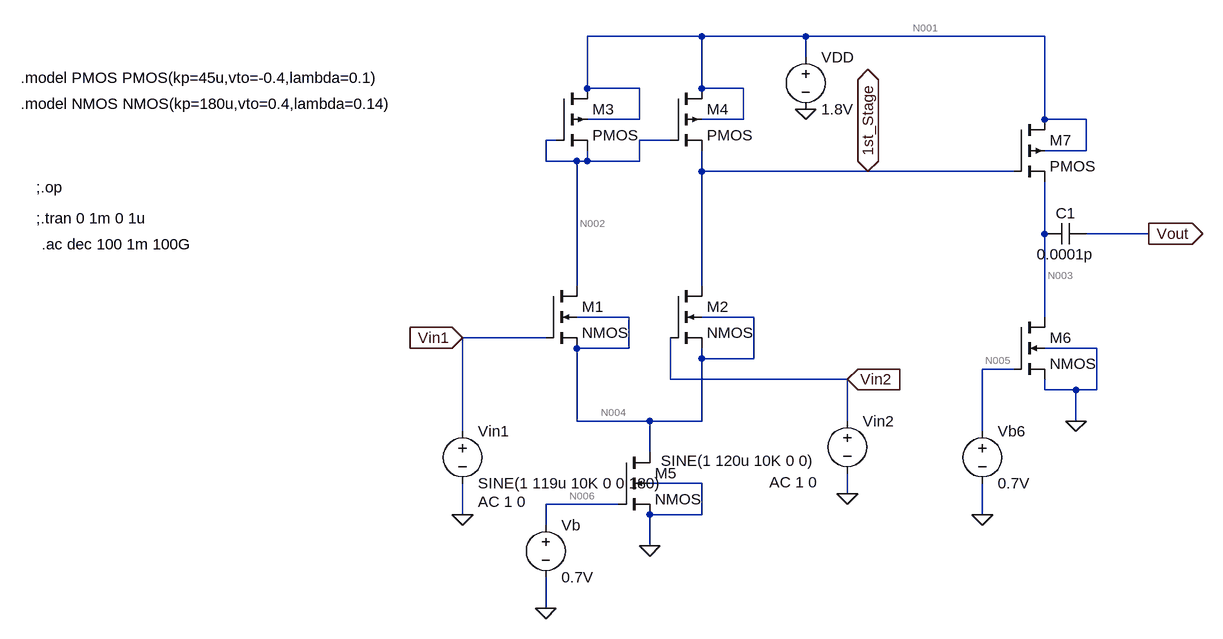
[diagram p0: schematic opamp.asc]
opamp.asc, the LTspice schematic file:
Version 4
SHEET 1 1836 1076
WIRE 224 176 48 176
WIRE 384 176 224 176
WIRE 752 176 384 176
WIRE 384 208 384 176
WIRE 48 256 48 176
WIRE 128 256 48 256
WIRE 224 256 224 176
WIRE 288 256 224 256
WIRE 128 304 128 256
WIRE 128 304 48 304
WIRE 288 304 288 256
WIRE 288 304 224 304
WIRE 752 304 752 176
WIRE 816 304 752 304
WIRE 0 336 -16 336
WIRE 176 336 128 336
WIRE 816 352 816 304
WIRE 816 352 752 352
WIRE -16 368 -16 336
WIRE 32 368 -16 368
WIRE 48 368 48 352
WIRE 48 368 32 368
WIRE 128 368 128 336
WIRE 128 368 48 368
WIRE 224 384 224 352
WIRE 480 384 224 384
WIRE 704 384 480 384
WIRE 752 480 752 400
WIRE 912 480 816 480
WIRE 32 560 32 368
WIRE 224 560 224 384
WIRE 112 608 32 608
WIRE 304 608 224 608
WIRE 752 608 752 480
WIRE -16 640 -144 640
WIRE 112 656 112 608
WIRE 112 656 32 656
WIRE 832 656 752 656
WIRE 224 672 224 656
WIRE 304 672 304 608
WIRE 304 672 224 672
WIRE 704 688 656 688
WIRE 176 704 176 640
WIRE 448 704 176 704
WIRE 752 720 752 704
WIRE 800 720 752 720
WIRE 832 720 832 656
WIRE 832 720 800 720
WIRE 32 768 32 656
WIRE 144 768 32 768
WIRE 224 768 224 672
WIRE 224 768 144 768
WIRE 448 768 448 704
WIRE 800 768 800 720
WIRE -144 784 -144 640
WIRE 656 784 656 688
WIRE 144 816 144 768
WIRE 224 864 144 864
WIRE 448 880 448 848
WIRE 96 896 -16 896
WIRE -144 912 -144 864
WIRE 224 912 224 864
WIRE 224 912 144 912
WIRE 656 912 656 864
WIRE -16 928 -16 896
WIRE 144 960 144 912
WIRE -16 1056 -16 1008
FLAG 384 288 0
FLAG -144 912 0
FLAG 448 880 0
FLAG -144 640 Vin1
IOPIN -144 640 In
FLAG 448 704 Vin2
IOPIN 448 704 In
FLAG 144 960 0
FLAG -16 1056 0
FLAG 656 912 0
FLAG 912 480 Vout
IOPIN 912 480 Out
FLAG 480 384 1st_Stage
IOPIN 480 384 BiDir
FLAG 800 768 0
SYMBOL pmos4 176 256 R0
SYMATTR InstName M4
SYMATTR Value2 l=0.8u w=10.25u
SYMBOL voltage 384 192 R0
WINDOW 123 0 0 Left 0
WINDOW 39 0 0 Left 0
SYMATTR InstName VDD
SYMATTR Value 1.8V
SYMBOL nmos4 176 560 R0
SYMATTR InstName M2
SYMATTR Value2 l=0.8u w=5.8u
SYMBOL pmos4 0 256 R0
SYMATTR InstName M3
SYMATTR Value2 l=0.8u w=10.25u
SYMBOL voltage -144 768 R0
WINDOW 123 24 124 Left 2
WINDOW 39 0 0 Left 0
SYMATTR Value2 AC 1 0
SYMATTR InstName Vin1
SYMATTR Value SINE(1 119u 10K 0 0 180)
SYMBOL nmos4 -16 560 R0
SYMATTR InstName M1
SYMATTR Value2 l=0.8u w=5.8u
SYMBOL voltage 448 752 R0
WINDOW 123 -120 110 Left 2
WINDOW 39 0 0 Left 0
WINDOW 3 -287 77 Left 2
SYMATTR Value2 AC 1 0
SYMATTR InstName Vin2
SYMATTR Value SINE(1 120u 10K 0 0)
SYMBOL nmos4 96 816 R0
SYMATTR InstName M5
SYMATTR Value2 l=0.8u w=9.87u
SYMBOL voltage -16 912 R0
WINDOW 123 24 124 Left 2
WINDOW 39 0 0 Left 0
SYMATTR InstName Vb
SYMATTR Value 0.7V
SYMBOL pmos4 704 304 R0
SYMATTR InstName M7
SYMATTR Value2 l=0.8u w=20.5u
SYMBOL cap 816 464 R90
WINDOW 0 0 32 VBottom 2
WINDOW 3 32 32 VTop 2
SYMATTR InstName C1
SYMATTR Value 0.0001p
SYMBOL nmos4 704 608 R0
SYMATTR InstName M6
SYMATTR Value2 l=0.8u w=9.87u
SYMBOL voltage 656 768 R0
WINDOW 123 24 124 Left 2
WINDOW 39 0 0 Left 0
SYMATTR InstName Vb6
SYMATTR Value 0.7V
TEXT -800 456 Left 2 !;.tran 0 1m 0 1u
TEXT -800 408 Left 2 !;.op
TEXT -792 496 Left 2 !.ac dec 100 1m 100G
TEXT -824 280 Left 2 !.model NMOS NMOS(kp=180u,vto=0.4,lambda=0.14)
TEXT -824 240 Left 2 !.model PMOS PMOS(kp=45u,vto=-0.4,lambda=0.1)

The netlist it stands for:
* opamp.asc
M4 N001 N002 1st_Stage N001 PMOS l=0.8u w=10.25u
VDD N001 0 1.8V
M2 1st_Stage Vin2 N004 N004 NMOS l=0.8u w=5.8u
M3 N001 N002 N002 N001 PMOS l=0.8u w=10.25u
Vin1 Vin1 0 SINE(1 119u 10K 0 0 180) AC 1 0
M1 N002 Vin1 N004 N004 NMOS l=0.8u w=5.8u
Vin2 Vin2 0 SINE(1 120u 10K 0 0) AC 1 0
M5 N004 N006 0 0 NMOS l=0.8u w=9.87u
Vb N006 0 0.7V
M7 N001 1st_Stage N003 N001 PMOS l=0.8u w=20.5u
C1 Vout N003 0.0001p
M6 N003 N005 0 0 NMOS l=0.8u w=9.87u
Vb6 N005 0 0.7V
.model NMOS NMOS
.model PMOS PMOS
.lib standard.mos
;.tran 0 1m 0 1u
;.op
.ac dec 100 1m 100G
.model NMOS NMOS(kp=180u,vto=0.4,lambda=0.14)
.model PMOS PMOS(kp=45u,vto=-0.4,lambda=0.1)
.backanno
.end

* Results of the author's LTspice run, read from the files saved beside the schematic
* Operating Point, zero values left out:
*   V(n001) = 1.8 V
*   V(n002) = 990.4 mV
*   V(1st_stage) = 990.4 mV
*   V(vin2) = 1 V
*   V(n004) = 329.2 mV
*   V(vin1) = 1 V
*   V(n006) = 700 mV
*   V(n003) = 599.5 mV
*   V(n005) = 700 mV
*   Id(M6) = 108.3 µA
*   Is(M6) = -108.3 µA
*   Id(M5) = 104.5 µA
*   Is(M5) = -104.5 µA
*   Id(M1) = 52.27 µA
*   Is(M1) = -52.27 µA
*   Id(M2) = 52.27 µA
*   Is(M2) = -52.27 µA
*   Id(M7) = 108.3 µA
*   Ib(M7) = 1.211 pA
*   Is(M7) = -108.3 µA
*   Id(M3) = 52.27 µA
*   Is(M3) = -52.27 µA
*   Id(M4) = 52.27 µA
*   Is(M4) = -52.27 µA
*   I(Vdd) = -212.9 µA